# Altium schematic sheet IR_V2.SchDoc
size A
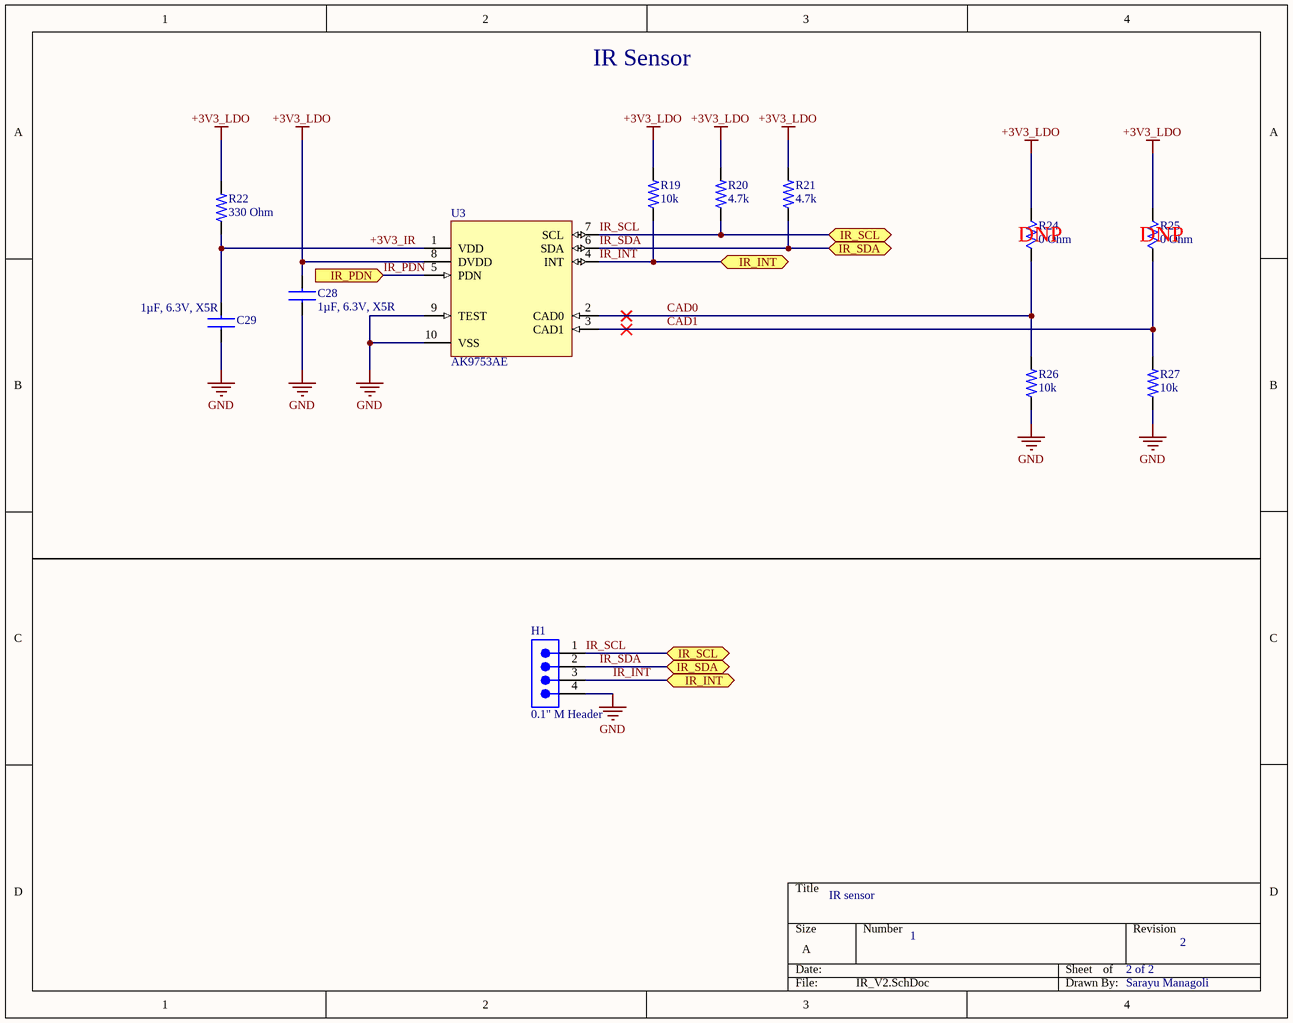
[diagram p0: IR_V2.SchDoc]

## Parts
C28  1µF, 6.3V, X5R  [CAPC2012X14N]
C29  1µF, 6.3V, X5R  [CAPC2012X14N]
H1  0.1" M Header  [4-PIN_MALE_HEADER_01-IN]
R19  10k  [RESC1508X06N_10K]
R20  4.7k  [RESC1608X06N_4_7]
R21  4.7k  [RESC1608X06N_4_7]
R22  330 Ohm  [RESC1608X06N_330]
R24  0 Ohm  [RES_0_0603]
R25  0 Ohm  [RES_0_0603]
R26  10k  [RESC1508X06N_10K]
R27  10k  [RESC1508X06N_10K]
U3  AK9753AE  [SON65P460X114-10N]

## Ports
IR_INT (bidir), IR_PDN (in), IR_SCL (bidir), IR_SDA (bidir)

## Nets
+3V3_LDO: C28.1 R19.2 R20.2 R21.2 R22.2 R24.2 R25.2 U3.8(DVDD)
GND: C28.2 C29.2 H1.4 R26.1 R27.1 U3.9(TEST) U3.10(VSS)
+3V3_IR: C29.1 R22.1 U3.1(VDD)
CAD0: R24.1 R26.2 U3.2(CAD0)
CAD1: R25.1 R27.2 U3.3(CAD1)
IR_INT: H1.3 R19.1 U3.4(INT) ; port IR_INT
IR_PDN: U3.5(PDN) ; port IR_PDN
IR_SCL: H1.1 R20.1 U3.7(SCL) ; port IR_SCL
IR_SDA: H1.2 R21.1 U3.6(SDA) ; port IR_SDA

## Notes on the sheet
- IR Sensor
- (near R24) DNP
- (near R25) DNP
- IR sensor
- 1
- 2 of 2
- 2
- Sarayu Managoli

## Library data of the parts
C28 C29 = CC0805KKX5R5BB105: CAP CER 1UF 6.3V X5R 0805; Manufacturer: Yageo; Tolerance: 10%; Supplier 1: Digi-Key; Manufacturer Part Number: CC0805KKX5R5BB105; RoHS: Yes; Category: Ceramic Capacitors; Stock 1: 1698; Pricing 1: 1=0.19000, 10=0.12900, 50=0.07740, 100=0.06540, 500=0.04474, 1000=0.03957 (USD); Mount: Surface Mount; Case/Package: 0805; Min Operating Temperature: -55°C; Max Operating Temperature: 85°C; Packaging: Tape and Reel; Capacitance: 1uF; Voltage Rating: 6.3V; Voltage Rating (DC): 6.3V; Dielectric: X5R; Length: 0.079inch; Width: 0.049inch; Thickness: 0.057inch; Lead Free: Lead Free; Halogen Free: Halogen Free; ComponentLink1URL: http://www.yageo.com/documents/recent/UPY-GPHC_X5R_4V-to-50V_25.pdf?src-supplier=Digi-Key; ComponentLink1Description: http://www.yageo.com/documents/recent/UPY-GPHC_X5R_4V-to-50V_25.pdf?src-supplier=Digi-Key; ComponentLink2URL: http://www.yageo.com/documents/recent/UPY-GPHC_X5R_4V-to-50V_23.pdf?src-supplier=Digi-Key; ComponentLink2Description: http://www.yageo.com/documents/recent/UPY-GPHC_X5R_4V-to-50V_23.pdf?src-supplier=Digi-Key; Supplier Part Number 1: 311-3417-1-ND
H1 = PRPC004SAAN-RC: CONN HEADER VERT 4POS 2.54MM; Manufacturer: Sullins; Connector Type: Header, Unshrouded, Breakaway; Number of Positions: 4; Number of Positions Loaded: All; Pitch: 0.100" (2.54mm); Online Catalog: 0.100" (2.54mm) Pitch Connector Headers; Other Names: S9510E-04  S9510E-04-ND; Supplier 1: Digi-Key; Manufacturer Part Number: PRPC004SAAN-RC; Stock 1: 6306; Pricing 1: 1=0.15, 10=0.146, 25=0.1084, 50=0.0928, 100=0.0898, 250=0.0774, 500=0.0743 (USD); Standard Package: 1; Category: Connectors, Interconnects; Family: Rectangular Connectors - Headers, Male Pins; Series: -; Packaging: Bulk; Contact Type: Male Pin; Number of Rows: 1; Row Spacing: -; Contact Mating Length: 0.230" (5.84mm); Mounting Type: Through Hole; Termination: Solder; Fastening Type: -; Features: -; Contact Finish: Gold; Contact Finish Thickness: Flash; Color: Black; ComponentLink1URL: https://media.digikey.com/PDF/Data%20Sheets/Sullins%20PDFs/xRxCzzzSxxN-RC_ST_11635-B.pdf?src-supplier=Digi-Key; ComponentLink1Description: https://media.digikey.com/PDF/Data%20Sheets/Sullins%20PDFs/xRxCzzzSxxN-RC_ST_11635-B.pdf?src-supplier=Digi-Key; Supplier Part Number 1: S1011EC-04-ND
R19 R26 R27 = CPF0603F10KC1: Res Thin Film 0603 10K Ohm 1% 1/16W ±50ppm/°C Molded SMD SMD Paper T/R; Manufacturer: TE Connectivity Neohm; Resistance: 10kR; Power Rating: 63mW; Voltage Rating: 50V; Number of Resistors: 1; Supplier 1: Digi-Key; Manufacturer Part Number: CPF0603F10KC1; RoHS: Yes; Category: Chip SMD Resistors; Stock 1: 42911; Pricing 1: 1=0.17000, 10=0.14400, 100=0.05630 (USD); Mount: Surface Mount; Case/Package: 0603; Number of Pins: 2; Case Code (Metric): 1608; Case Code (Imperial): 0603; Min Operating Temperature: -55°C; Max Operating Temperature: 155°C; Tolerance: 1%; Packaging: Tape and Reel; Resistor Type: Thin Film; Temperature Coefficient: 50ppm/°C; Number of Terminations: 2; Termination: Solder; Voltage Rating (DC): 50V; Width: 0.8mm; Radiation Hardening: No; REACH SVHC: Unknown; ELV: Compliant; ComponentLink1URL: https://datasheet.ciiva.com/7789/eng-ds-1773200-j-7789563.pdf?src-supplier=Element14; ComponentLink1Description: https://datasheet.ciiva.com/7789/eng-ds-1773200-j-7789563.pdf?src-supplier=Element14; ComponentLink2URL: https://datasheet.ciiva.com/22692/1786775-22692861.pdf?src-supplier=Element14; ComponentLink2Description: https://datasheet.ciiva.com/22692/1786775-22692861.pdf?src-supplier=Element14; ComponentLink3URL: https://datasheet.ciiva.com/24494/29261eng-ds-1773200-f-24494553.pdf?src-supplier=Onlinecomponents.com; ComponentLink3Description: https://datasheet.ciiva.com/24494/29261eng-ds-1773200-f-24494553.pdf?src-supplier=Onlinecomponents.com; Supplier Part Number 1: A102203CT-ND
R20 R21 = MCT06030C4701FP500: RES SMD 4.7K OHM 1% 1/8W 0603; Manufacturer: Vishay Beyschlag; Max Power Dissipation: 125mW; Temperature Coefficient: 50ppm/°C; Voltage Rating (DC): 75V; Resistance: 4.7kR; Supplier 1: Digi-Key; Manufacturer Part Number: MCT06030C4701FP500; RoHS: Yes; Category: Chip SMD Resistors; Stock 1: 67430; Pricing 1: 1=0.16000, 10=0.13200, 100=0.05160, 1000=0.02160, 2500=0.01980 (USD); Mount: Surface Mount; Case/Package: 0603; Contact Plating: Tin; Case Code (Imperial): 0603; Case Code (Metric): 1608; Min Operating Temperature: -55°C; Max Operating Temperature: 125°C; Tolerance: 1%; Packaging: Tape and Reel; Power Rating: 125mW; Package Quantity: 1; Resistor Type: Thin Film; Number of Terminations: 2; Voltage Rating: 75V; Length: 1.55mm; Height: 0.022inch; Width: 0.033inch; Depth: 0.85mm; Radiation Hardening: No; Lead Free: Lead Free; Military Standard: Not; REACH SVHC: No SVHC; ComponentLink1URL: https://datasheet.ciiva.com/8897/mc-pro-8897829.pdf?src-supplier=Avnet; ComponentLink1Description: https://datasheet.ciiva.com/8897/mc-pro-8897829.pdf?src-supplier=Avnet; ComponentLink2URL: https://datasheet.ciiva.com/2525/mc-pro-2525199.pdf?src-supplier=Digi-Key; ComponentLink2Description: https://datasheet.ciiva.com/2525/mc-pro-2525199.pdf?src-supplier=Digi-Key; ComponentLink3URL: https://datasheet.ciiva.com/16452/mc-pro-16452668.pdf?src-supplier=Future+Electronics; ComponentLink3Description: https://datasheet.ciiva.com/16452/mc-pro-16452668.pdf?src-supplier=Future+Electronics; ComponentLink4URL: https://datasheet.ciiva.com/2525/mc-pro-2525197.pdf?src-supplier=Digi-Key; ComponentLink4Description: https://datasheet.ciiva.com/2525/mc-pro-2525197.pdf?src-supplier=Digi-Key; ComponentLink5URL: https://datasheet.ciiva.com/2525/mc-pro-2525198.pdf?src-supplier=Digi-Key; ComponentLink5Description: https://datasheet.ciiva.com/2525/mc-pro-2525198.pdf?src-supplier=Digi-Key; Supplier Part Number 1: MCT0603-4.70K-CFCT-ND
R22 = SR0603FR-7T330RL: RES SMD 0603 1/4W 1% 330 OHM; Manufacturer: Yageo; Supplier 1: Digi-Key; Manufacturer Part Number: SR0603FR-7T330RL; RoHS: No; Category: Chip SMD Resistors; Stock 1: 4990; Pricing 1: 1=0.71000, 10=0.52500, 100=0.30570, 1000=0.17143, 2500=0.16797 (USD); ComponentLink1URL: http://www.yageo.com/documents/recent/PYu-SR_D_F%20tol_RoHS_L_3.pdf?src-supplier=Digi-Key; ComponentLink1Description: http://www.yageo.com/documents/recent/PYu-SR_D_F%20tol_RoHS_L_3.pdf?src-supplier=Digi-Key; Supplier Part Number 1: YAG5835CT-ND
R24 R25 = RC0603JR-070RL: Jumper, 0 ohm, 0603 [Metrisch 1608], Baureihe RC, 75 V, Dickschicht; Manufacturer: Yageo; Resistance: 0mR; Tolerance: 1%; Power Rating: 100mW; Voltage Rating (DC): 50V; Temperature Coefficient: 200ppm/°C; Supplier 1: Digi-Key; Manufacturer Part Number: RC0603JR-070RL; RoHS: Yes; Category: Chip SMD Resistors; Stock 1: 12794789; Pricing 1: 1=0.10000, 10=0.01700, 25=0.01240, 50=0.00960, 100=0.00700, 250=0.00536, 500=0.00428, 1000=0.00315 (USD); Case/Package: 0603; Number of Pins: 2; Contact Plating: Tin,Matte; Case Code (Imperial): 0603; Case Code (Metric): 1608; Min Operating Temperature: -55°C; Max Operating Temperature: 155°C; Resistor Type: Thick Film; Packaging: Tape and Reel; Termination: SMD/SMT; Package Quantity: 5000; Voltage Rating: 50V; Length: 1.6mm; Height: 0.45mm; Width: 0.8mm; Depth: 0.8mm; Radiation Hardening: No; REACH SVHC: No SVHC; Lead Free: Lead Free; Military Standard: Not; ComponentLink1URL: https://datasheet.ciiva.com/11808/pyu-r-int-6-11808700.pdf?src-supplier=RSComponents; ComponentLink1Description: https://datasheet.ciiva.com/11808/pyu-r-int-6-11808700.pdf?src-supplier=RSComponents; ComponentLink2URL: https://datasheet.ciiva.com/7746/1738695-7746421.pdf?src-supplier=Element14; ComponentLink2Description: https://datasheet.ciiva.com/7746/1738695-7746421.pdf?src-supplier=Element14; ComponentLink3URL: https://datasheet.ciiva.com/8883/pyu-rc0603-51-rohs-l-4-8883045.pdf?src-supplier=Avnet; ComponentLink3Description: https://datasheet.ciiva.com/8883/pyu-rc0603-51-rohs-l-4-8883045.pdf?src-supplier=Avnet; ComponentLink4URL: https://datasheet.ciiva.com/15189/getdatasheetpartid-329462-15189845.pdf?src-supplier=Verical; ComponentLink4Description: https://datasheet.ciiva.com/15189/getdatasheetpartid-329462-15189845.pdf?src-supplier=Verical; ComponentLink5URL: https://datasheet.ciiva.com/7746/1738695-7746422.pdf?src-supplier=Element14; ComponentLink5Description: https://datasheet.ciiva.com/7746/1738695-7746422.pdf?src-supplier=Element14; ComponentLink6URL: https://datasheet.ciiva.com/12555/rc0603-272842-12555254.pdf?src-supplier=Mouser; ComponentLink6Description: https://datasheet.ciiva.com/12555/rc0603-272842-12555254.pdf?src-supplier=Mouser; ComponentLink7URL: https://datasheet.ciiva.com/22747/443971-22747530.pdf?src-supplier=Element14; ComponentLink7Description: https://datasheet.ciiva.com/22747/443971-22747530.pdf?src-supplier=Element14; Supplier Part Number 1: 311-0.0GRCT-ND
U3 = AK9753AE: IC 4CH IR SENSOR I2C 10SON; Manufacturer: AKM Semiconductor; Supplier 1: Digi-Key; Manufacturer Part Number: AK9753AE; RoHS: No; Category: Sensors; Stock 1: 1905; Pricing 1: 1=10.55000, 5=9.25000, 10=8.32500, 25=7.40000, 50=6.84500, 100=5.92000, 500=5.55000 (USD); Mount: Surface Mount; Case/Package: SMD/SMT; Min Operating Temperature: -30°C; Max Operating Temperature: 85°C; Output Type: I2C; Packaging: Cut Tape; Supplier Part Number 1: 974-1157-1-ND